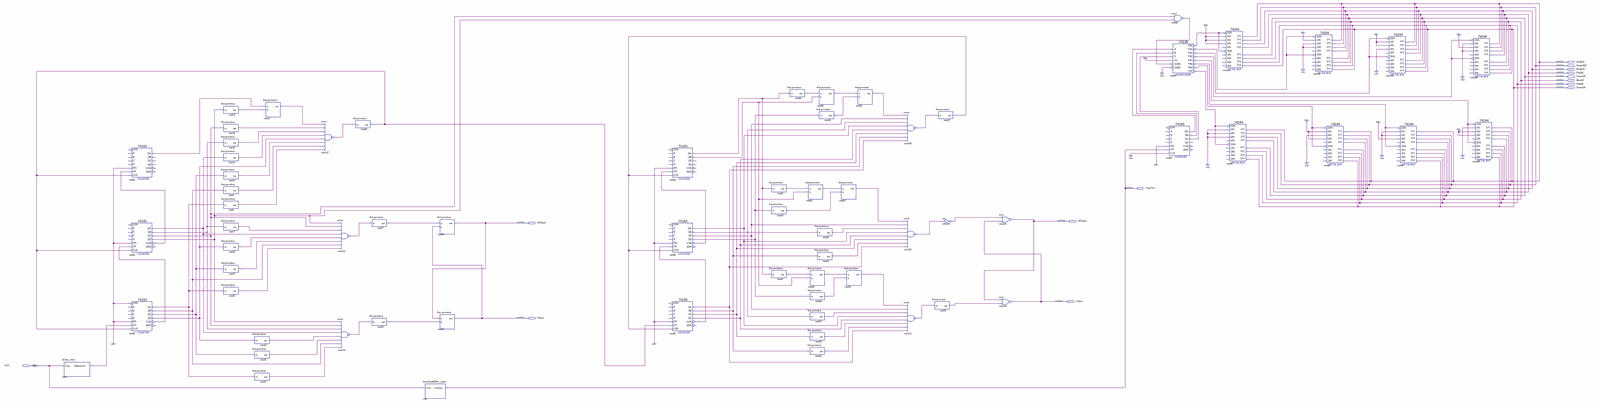
[diagram p0: schematic sheet, whole]
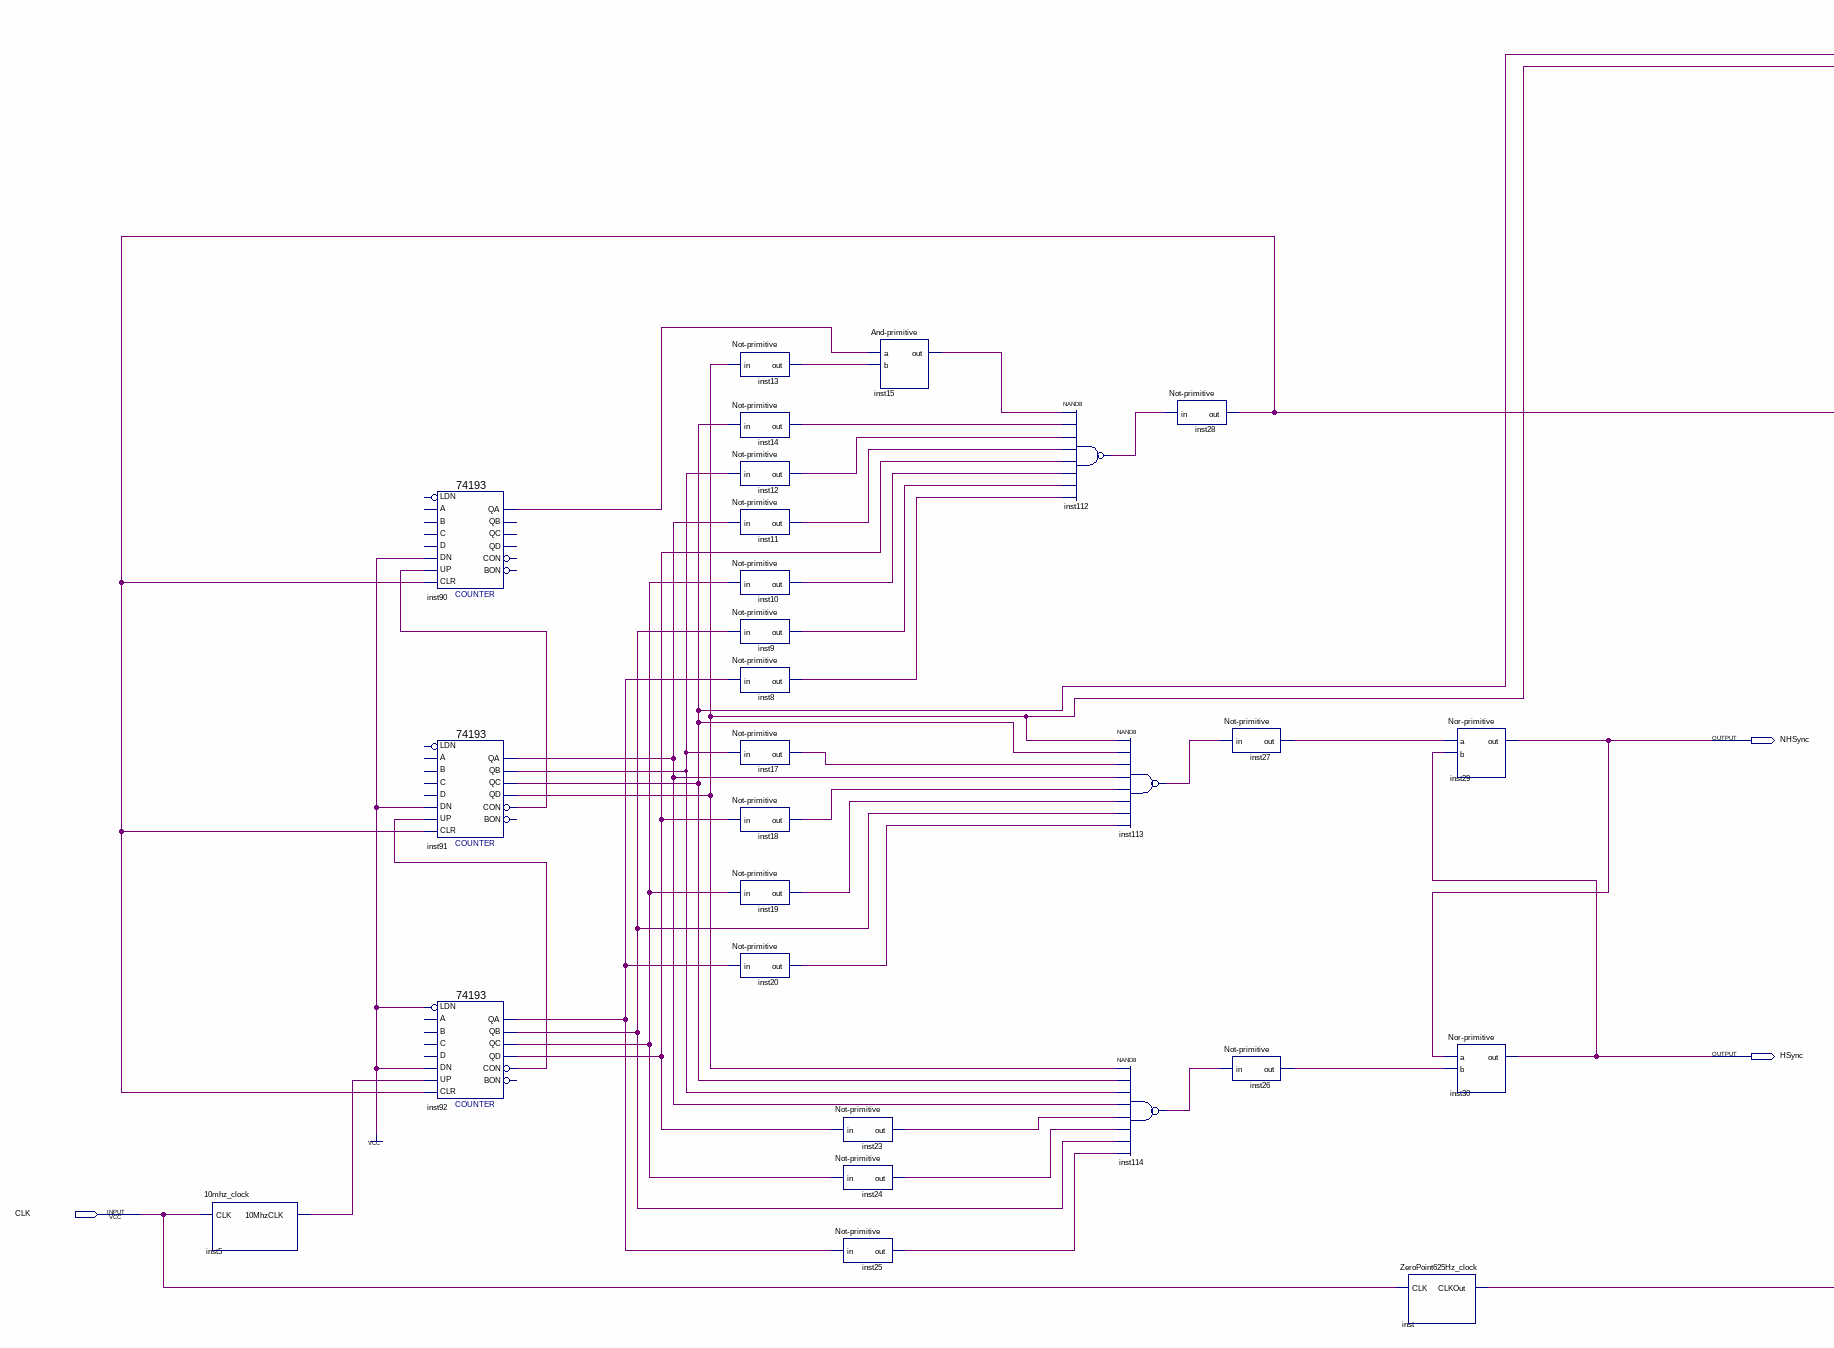
[diagram p1: schematic sheet, left part]
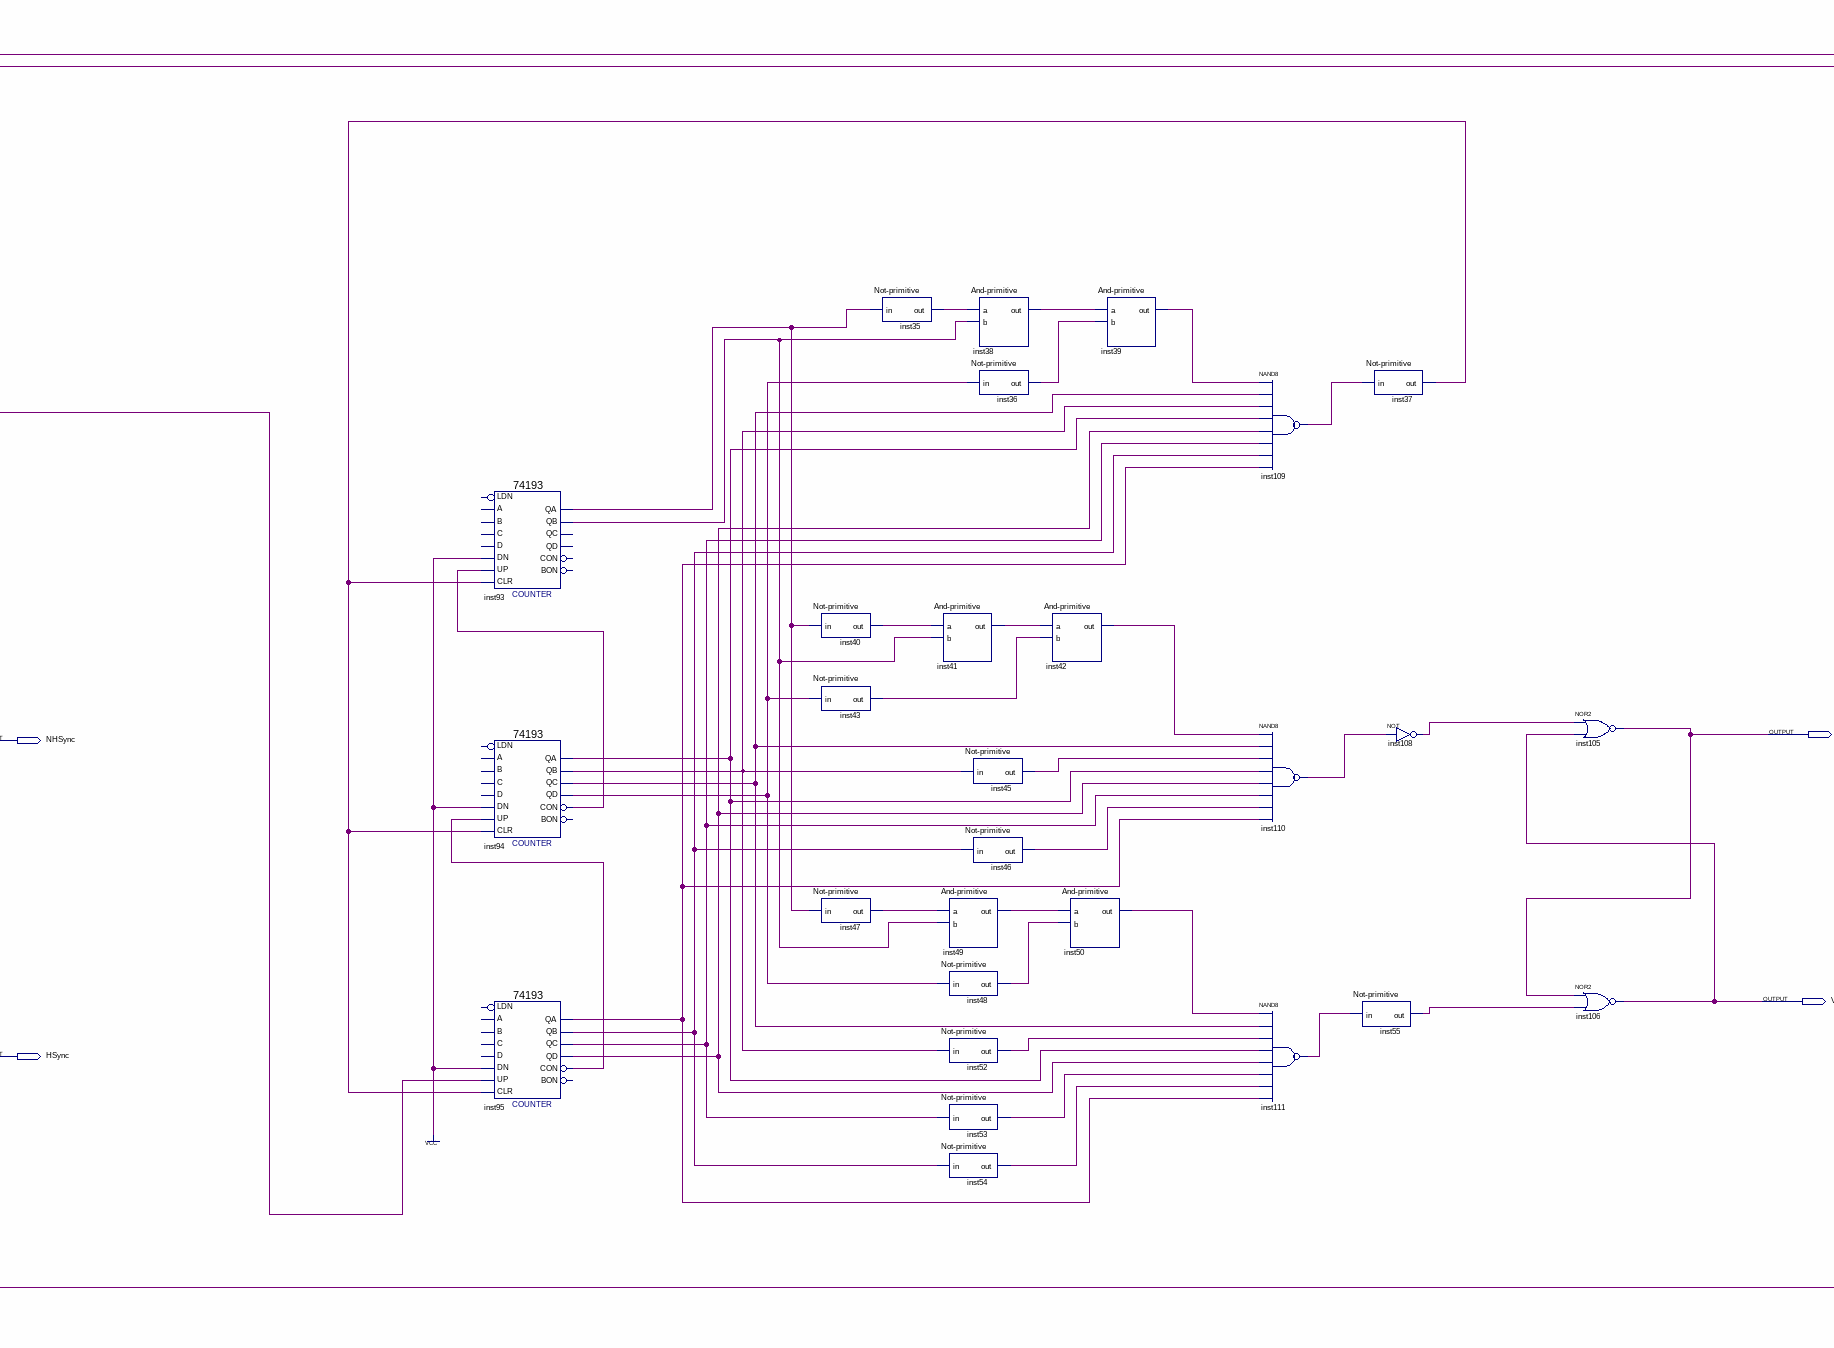
[diagram p2: schematic sheet, centre part]
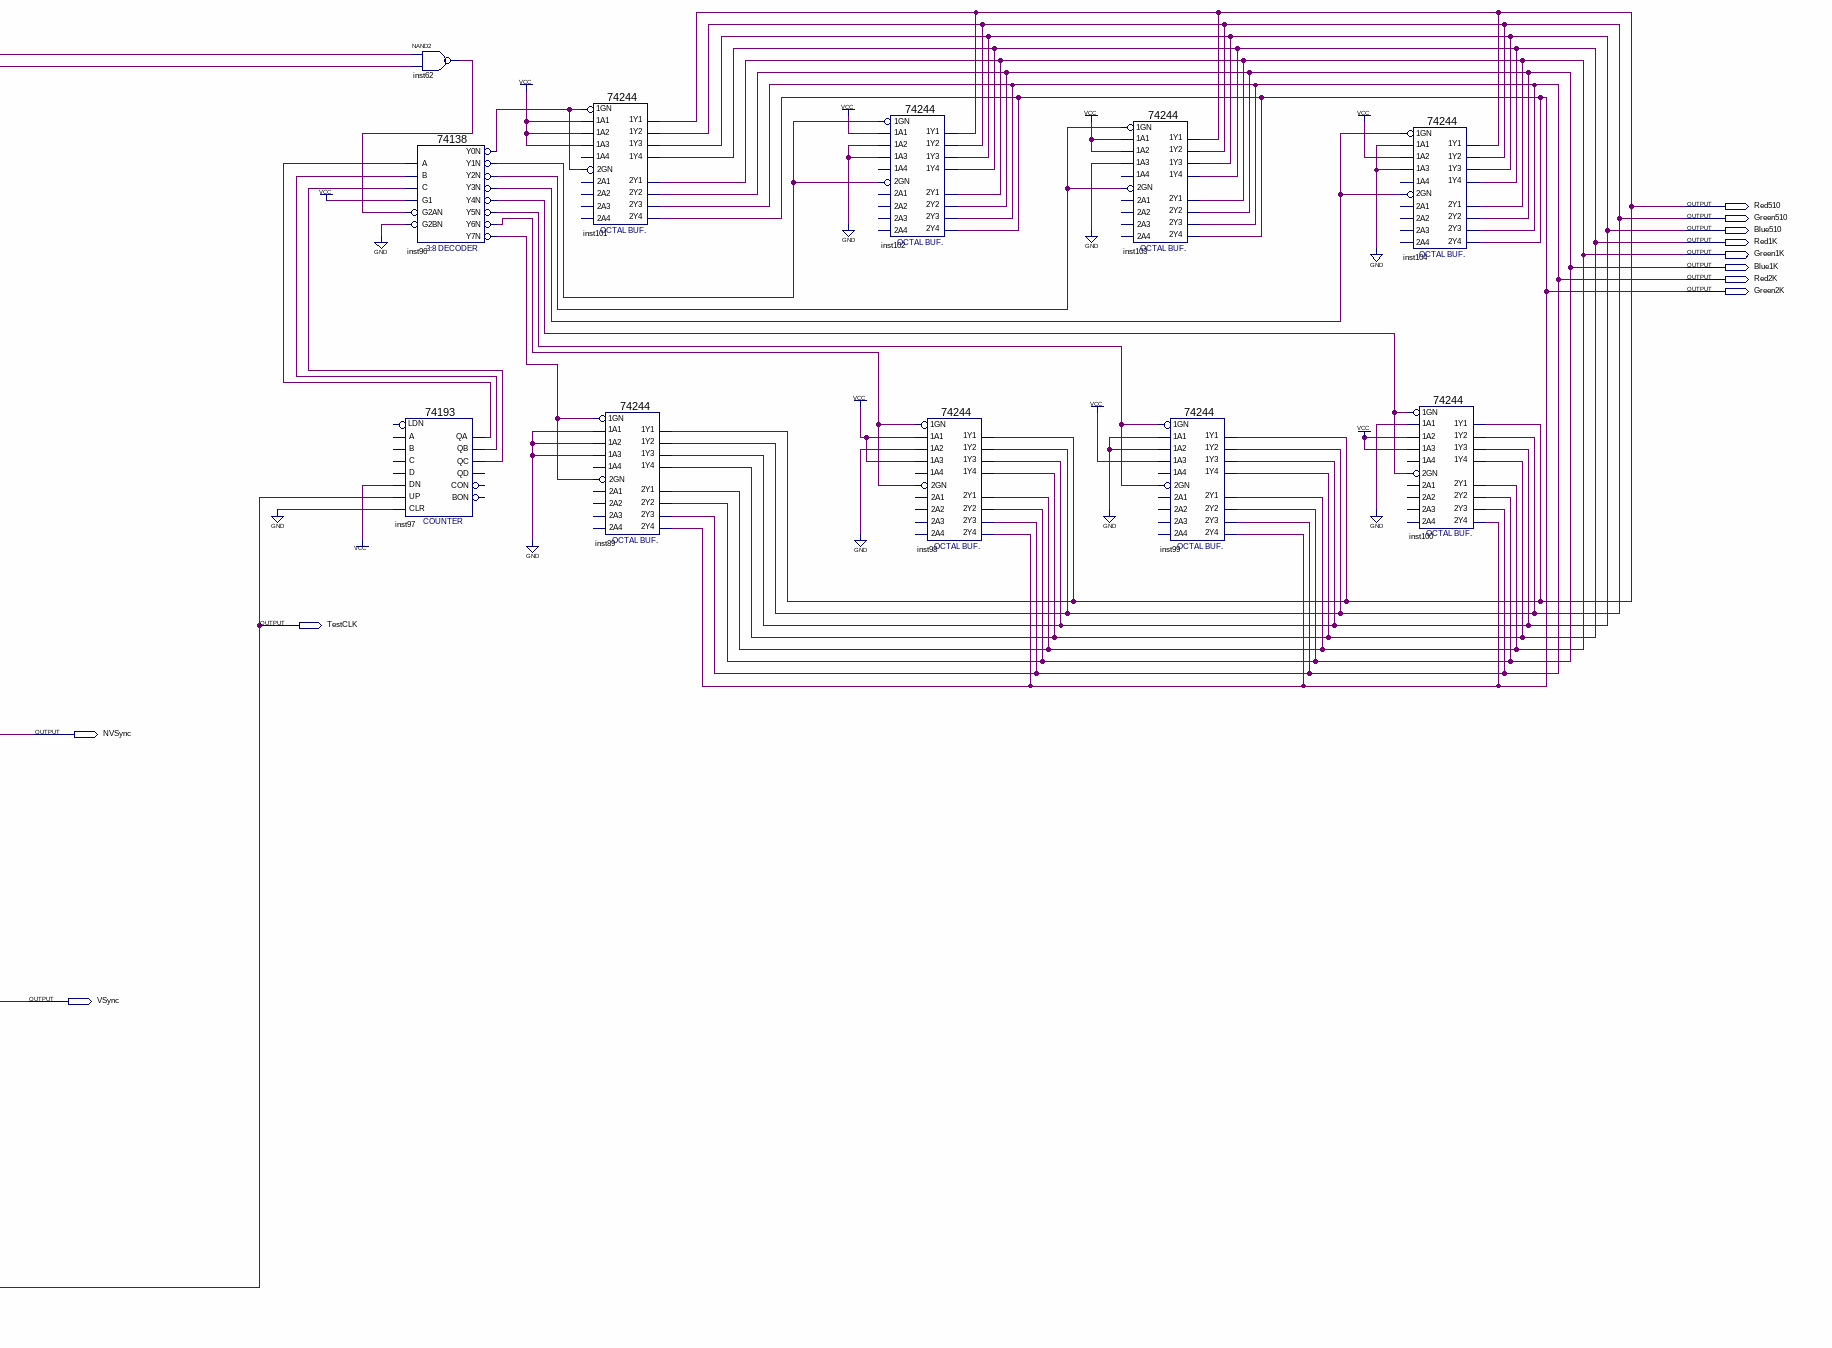
[diagram p3: schematic sheet, right part]
// Quartus schematic FPGA-VGA-Top.bdf as structural Verilog: 67 symbols, 14 pins
module \FPGA-VGA-Top  (
  input  CLK,
  output Red510,
  output Green510,
  output Blue510,
  output Red1K,
  output Green1K,
  output Blue1K,
  output Red2K,
  output Green2K,
  output TestCLK,
  output NVSync,
  output NHSync,
  output VSync,
  output HSync
);

  wire inst5_10mhzclk, inst8_out, inst9_out, inst10_out, inst11_out, inst12_out, inst13_out, inst14_out,
       inst15_out, inst17_out, inst18_out, inst19_out, inst20_out, inst23_out, inst24_out, inst25_out,
       inst26_out, inst27_out, inst28_out, inst35_out, inst36_out, inst37_out, inst38_out, inst39_out,
       inst40_out, inst41_out, inst42_out, inst43_out, inst45_out, inst46_out, inst47_out, inst48_out,
       inst49_out, inst50_out, inst52_out, inst53_out, inst54_out, inst55_out, inst62_out, inst90_qa,
       inst91_con, inst91_qa, inst91_qb, inst91_qc, inst91_qd, inst92_con, inst92_qa, inst92_qb, inst92_qc,
       inst92_qd, inst93_qa, inst93_qb, inst94_con, inst94_qa, inst94_qb, inst94_qc, inst94_qd, inst95_con,
       inst95_qa, inst95_qb, inst95_qc, inst95_qd, inst96_y0n, inst96_y1n, inst96_y2n, inst96_y3n,
       inst96_y4n, inst96_y5n, inst96_y6n, inst96_y7n, inst97_qa, inst97_qb, inst97_qc, inst108_out,
       inst109_out, inst110_out, inst111_out, inst112_out, inst113_out, inst114_out;

  \10mhz_clock  inst5 (.CLK(CLK), .\10MhzCLK (inst5_10mhzclk));
  \74193  inst90 (
    .CLR(inst28_out), .UP(inst91_con), .DN(1'b1), .QA(inst90_qa));  // open: D, C, B, A, LDN, QB, CON, QD, QC, BON
  \74193  inst91 (
    .CLR(inst28_out), .UP(inst92_con), .DN(1'b1), .QB(inst91_qb), .QA(inst91_qa), .CON(inst91_con),
    .QD(inst91_qd), .QC(inst91_qc));  // open: D, C, B, A, LDN, BON
  \74193  inst92 (
    .CLR(inst28_out), .UP(inst5_10mhzclk), .DN(1'b1), .LDN(1'b1), .QB(inst92_qb), .QA(inst92_qa),
    .CON(inst92_con), .QD(inst92_qd), .QC(inst92_qc));  // open: D, C, B, A, BON
  \Not-primitive  inst13 (.in(inst91_qd), .out(inst13_out));
  \Not-primitive  inst14 (.in(inst91_qc), .out(inst14_out));
  \Not-primitive  inst12 (.in(inst91_qb), .out(inst12_out));
  \Not-primitive  inst11 (.in(inst91_qa), .out(inst11_out));
  \Not-primitive  inst10 (.in(inst92_qc), .out(inst10_out));
  \Not-primitive  inst9 (.in(inst92_qb), .out(inst9_out));
  \Not-primitive  inst8 (.in(inst92_qa), .out(inst8_out));
  \Not-primitive  inst17 (.in(inst91_qb), .out(inst17_out));
  \Not-primitive  inst18 (.in(inst92_qd), .out(inst18_out));
  \Not-primitive  inst19 (.in(inst92_qc), .out(inst19_out));
  \Not-primitive  inst20 (.in(inst92_qa), .out(inst20_out));
  \And-primitive  inst15 (.a(inst90_qa), .b(inst13_out), .out(inst15_out));
  \Not-primitive  inst23 (.in(inst92_qd), .out(inst23_out));
  \Not-primitive  inst24 (.in(inst92_qc), .out(inst24_out));
  \Not-primitive  inst25 (.in(inst92_qa), .out(inst25_out));
  nand inst112 (inst112_out, inst15_out, inst14_out, inst12_out, inst11_out, inst92_qd, inst10_out, inst9_out, inst8_out);
  nand inst113 (inst113_out, inst91_qd, inst91_qc, inst17_out, inst91_qa, inst18_out, inst19_out, inst92_qb, inst20_out);
  nand inst114 (inst114_out, inst91_qd, inst91_qc, inst91_qb, inst91_qa, inst23_out, inst24_out, inst92_qb, inst25_out);
  \Not-primitive  inst28 (.in(inst112_out), .out(inst28_out));
  \Not-primitive  inst27 (.in(inst113_out), .out(inst27_out));
  \Not-primitive  inst26 (.in(inst114_out), .out(inst26_out));
  ZeroPoint625Hz_clock inst (.CLK(CLK), .CLKOut(TestCLK));
  \Nor-primitive  inst29 (.a(inst27_out), .b(HSync), .out(NHSync));
  \Nor-primitive  inst30 (.a(NHSync), .b(inst26_out), .out(HSync));
  \74193  inst93 (
    .CLR(inst37_out), .UP(inst94_con), .DN(1'b1), .QB(inst93_qb), .QA(inst93_qa));  // open: D, C, B, A, LDN, CON, QD, QC, BON
  \74193  inst94 (
    .CLR(inst37_out), .UP(inst95_con), .DN(1'b1), .QB(inst94_qb), .QA(inst94_qa), .CON(inst94_con),
    .QD(inst94_qd), .QC(inst94_qc));  // open: D, C, B, A, LDN, BON
  \74193  inst95 (
    .CLR(inst37_out), .UP(inst28_out), .DN(1'b1), .QB(inst95_qb), .QA(inst95_qa), .CON(inst95_con),
    .QD(inst95_qd), .QC(inst95_qc));  // open: D, C, B, A, LDN, BON
  \Not-primitive  inst40 (.in(inst93_qa), .out(inst40_out));
  \Not-primitive  inst43 (.in(inst94_qd), .out(inst43_out));
  \Not-primitive  inst47 (.in(inst93_qa), .out(inst47_out));
  \Not-primitive  inst35 (.in(inst93_qa), .out(inst35_out));
  \And-primitive  inst41 (.a(inst40_out), .b(inst93_qb), .out(inst41_out));
  \And-primitive  inst49 (.a(inst47_out), .b(inst93_qb), .out(inst49_out));
  \Not-primitive  inst48 (.in(inst94_qd), .out(inst48_out));
  \Not-primitive  inst52 (.in(inst94_qb), .out(inst52_out));
  \Not-primitive  inst53 (.in(inst95_qc), .out(inst53_out));
  \Not-primitive  inst54 (.in(inst95_qb), .out(inst54_out));
  \And-primitive  inst38 (.a(inst35_out), .b(inst93_qb), .out(inst38_out));
  \Not-primitive  inst36 (.in(inst94_qd), .out(inst36_out));
  \Not-primitive  inst45 (.in(inst94_qb), .out(inst45_out));
  \Not-primitive  inst46 (.in(inst95_qb), .out(inst46_out));
  \And-primitive  inst42 (.a(inst41_out), .b(inst43_out), .out(inst42_out));
  \And-primitive  inst50 (.a(inst49_out), .b(inst48_out), .out(inst50_out));
  \And-primitive  inst39 (.a(inst38_out), .b(inst36_out), .out(inst39_out));
  nand inst109 (inst109_out, inst39_out, inst94_qc, inst94_qb, inst94_qa, inst95_qd, inst95_qc, inst95_qb, inst95_qa);
  nand inst110 (inst110_out, inst42_out, inst94_qc, inst45_out, inst94_qa, inst95_qd, inst95_qc, inst46_out, inst95_qa);
  nand inst111 (inst111_out, inst50_out, inst94_qc, inst52_out, inst94_qa, inst95_qd, inst53_out, inst54_out, inst95_qa);
  \Not-primitive  inst37 (.in(inst109_out), .out(inst37_out));
  \Not-primitive  inst55 (.in(inst111_out), .out(inst55_out));
  not inst108 (inst108_out, inst110_out);
  nor inst105 (NVSync, inst108_out, VSync);
  nor inst106 (VSync, NVSync, inst55_out);
  nand inst62 (inst62_out, inst91_qc, inst91_qd);
  \74138  inst96 (
    .A(inst97_qa), .B(inst97_qb), .G1(1'b1), .C(inst97_qc), .G2AN(inst62_out), .G2BN(1'b0), .Y0N(inst96_y0n),
    .Y1N(inst96_y1n), .Y2N(inst96_y2n), .Y3N(inst96_y3n), .Y4N(inst96_y4n), .Y5N(inst96_y5n),
    .Y6N(inst96_y6n), .Y7N(inst96_y7n));
  \74193  inst97 (
    .CLR(1'b0), .UP(TestCLK), .DN(1'b1), .QB(inst97_qb), .QA(inst97_qa), .QC(inst97_qc));  // open: D, C, B, A, LDN, CON, QD, BON
  \74244  inst101 (
    .\1A2 (1'b1), .\1A1 (1'b1), .\1A3 (1'b1), .\1GN (inst96_y0n), .\2GN (inst96_y0n), .\1Y2 (Green510),
    .\1Y4 (Red1K), .\2Y1 (Green1K), .\1Y1 (Red510), .\2Y3 (Red2K), .\2Y4 (Green2K), .\1Y3 (Blue510),
    .\2Y2 (Blue1K));  // open: 1A4, 2A3, 2A1, 2A4, 2A2
  \74244  inst89 (
    .\1A2 (1'b0), .\1A1 (1'b0), .\1A3 (1'b0), .\1GN (inst96_y7n), .\2GN (inst96_y7n), .\1Y2 (Green510),
    .\1Y4 (Red1K), .\2Y1 (Green1K), .\1Y1 (Red510), .\2Y3 (Red2K), .\2Y4 (Green2K), .\1Y3 (Blue510),
    .\2Y2 (Blue1K));  // open: 1A4, 2A3, 2A1, 2A4, 2A2
  \74244  inst102 (
    .\1A2 (1'b0), .\1A1 (1'b1), .\1A3 (1'b0), .\1GN (inst96_y1n), .\2GN (inst96_y1n), .\1Y2 (Green510),
    .\1Y4 (Red1K), .\2Y1 (Green1K), .\1Y1 (Red510), .\2Y3 (Red2K), .\2Y4 (Green2K), .\1Y3 (Blue510),
    .\2Y2 (Blue1K));  // open: 1A4, 2A3, 2A1, 2A4, 2A2
  \74244  inst98 (
    .\1A2 (1'b0), .\1A1 (1'b1), .\1A3 (1'b1), .\1GN (inst96_y6n), .\2GN (inst96_y6n), .\1Y2 (Green510),
    .\1Y4 (Red1K), .\2Y1 (Green1K), .\1Y1 (Red510), .\2Y3 (Red2K), .\2Y4 (Green2K), .\1Y3 (Blue510),
    .\2Y2 (Blue1K));  // open: 1A4, 2A3, 2A1, 2A4, 2A2
  \74244  inst103 (
    .\1A2 (1'b1), .\1A1 (1'b1), .\1A3 (1'b0), .\1GN (inst96_y2n), .\2GN (inst96_y2n), .\1Y2 (Green510),
    .\1Y4 (Red1K), .\2Y1 (Green1K), .\1Y1 (Red510), .\2Y3 (Red2K), .\2Y4 (Green2K), .\1Y3 (Blue510),
    .\2Y2 (Blue1K));  // open: 1A4, 2A3, 2A1, 2A4, 2A2
  \74244  inst99 (
    .\1A2 (1'b0), .\1A1 (1'b0), .\1A3 (1'b1), .\1GN (inst96_y5n), .\2GN (inst96_y5n), .\1Y2 (Green510),
    .\1Y4 (Red1K), .\2Y1 (Green1K), .\1Y1 (Red510), .\2Y3 (Red2K), .\2Y4 (Green2K), .\1Y3 (Blue510),
    .\2Y2 (Blue1K));  // open: 1A4, 2A3, 2A1, 2A4, 2A2
  \74244  inst104 (
    .\1A2 (1'b1), .\1A1 (1'b0), .\1A3 (1'b0), .\1GN (inst96_y3n), .\2GN (inst96_y3n), .\1Y2 (Green510),
    .\1Y4 (Red1K), .\2Y1 (Green1K), .\1Y1 (Red510), .\2Y3 (Red2K), .\2Y4 (Green2K), .\1Y3 (Blue510),
    .\2Y2 (Blue1K));  // open: 1A4, 2A3, 2A1, 2A4, 2A2
  \74244  inst100 (
    .\1A2 (1'b1), .\1A1 (1'b0), .\1A3 (1'b1), .\1GN (inst96_y4n), .\2GN (inst96_y4n), .\1Y2 (Green510),
    .\1Y4 (Red1K), .\2Y1 (Green1K), .\1Y1 (Red510), .\2Y3 (Red2K), .\2Y4 (Green2K), .\1Y3 (Blue510),
    .\2Y2 (Blue1K));  // open: 1A4, 2A3, 2A1, 2A4, 2A2
endmodule
